# EAGLE design Qwiic MP3 (EAGLE 9.2.1)
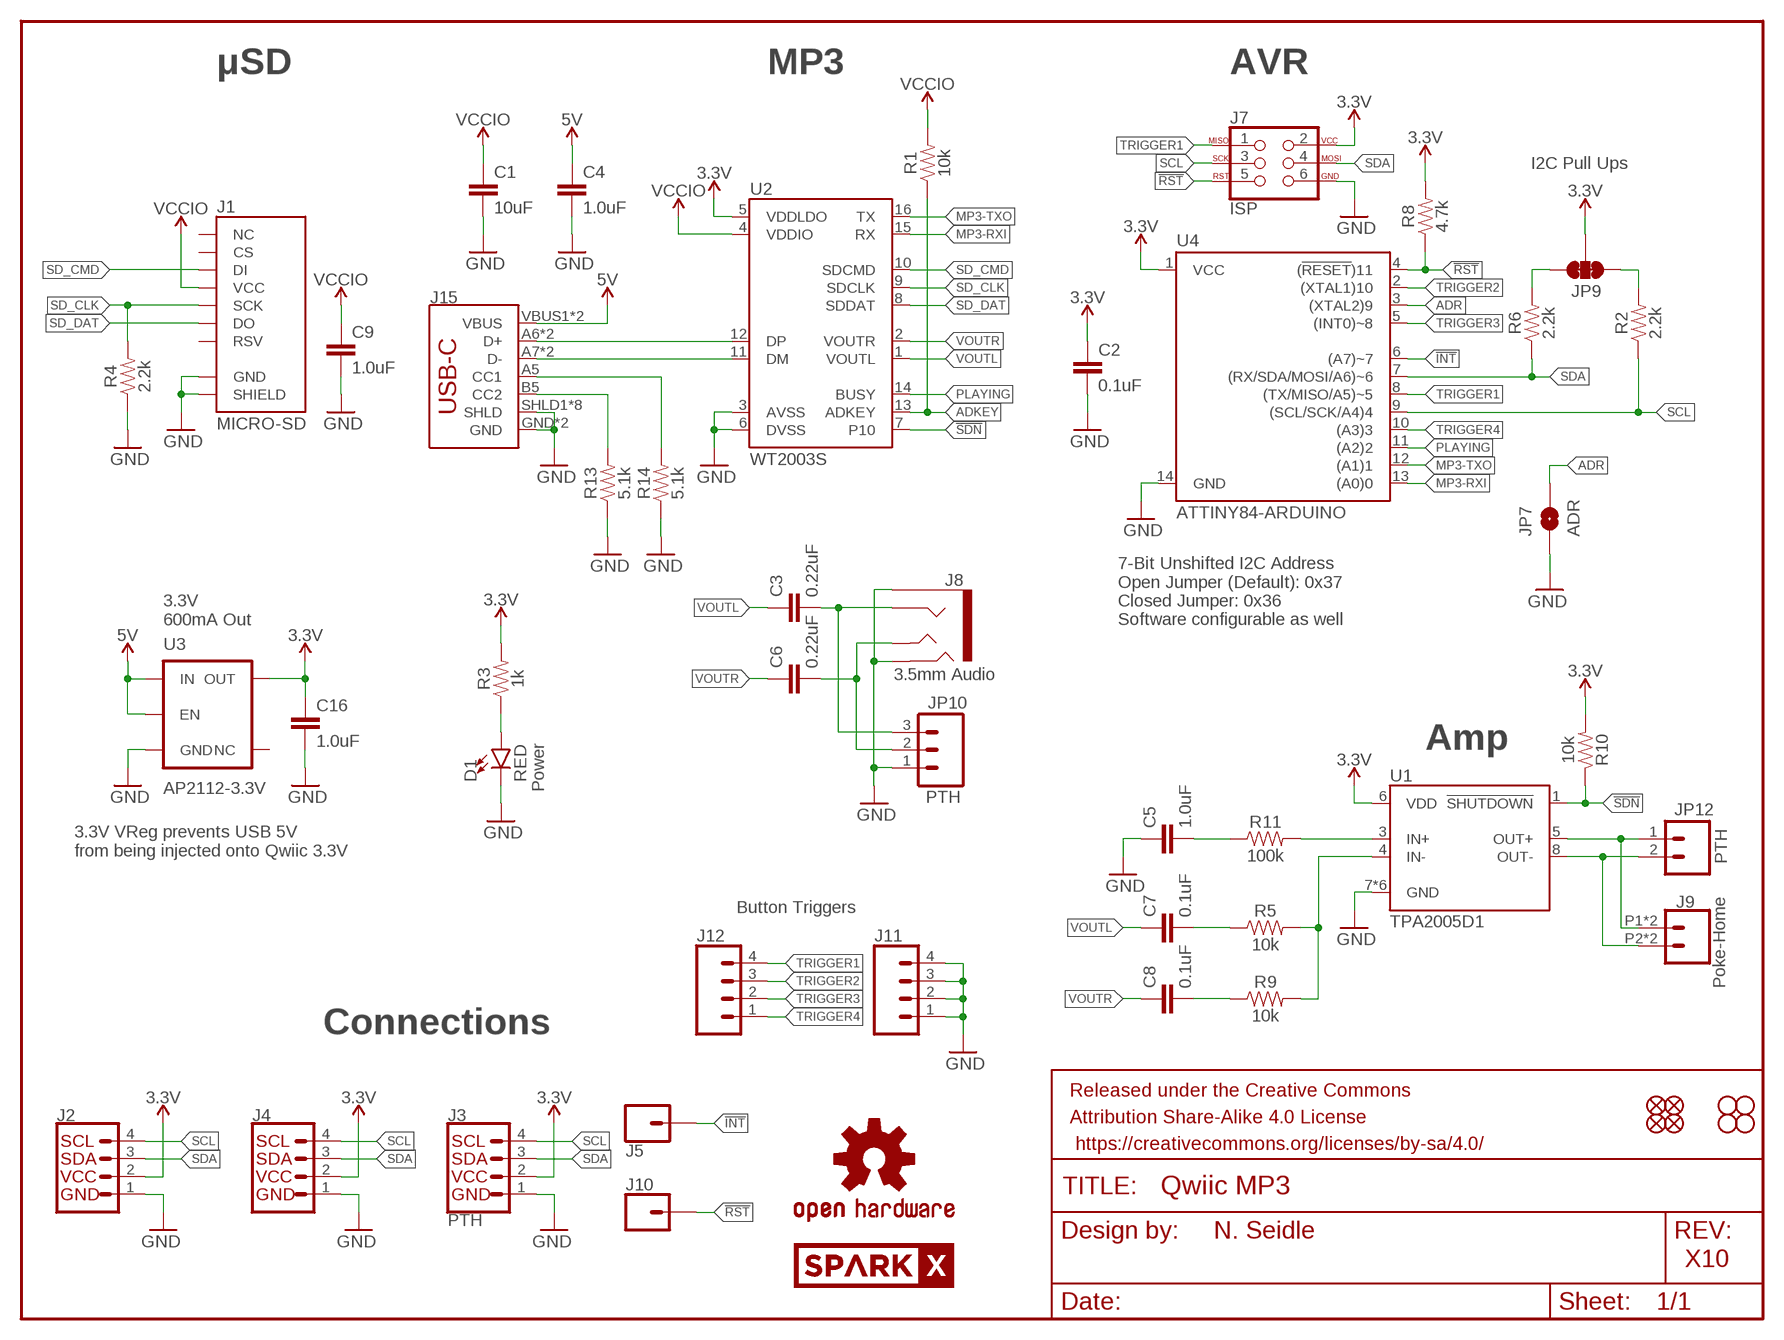
[diagram p0: schematic, sheet 1]

## Parts
C1  10uF  10UF-0603-6.3V-20%  [0603]
C2  0.1uF  0.1UF-0603-25V-(+80/-20%)  [0603]
C3  0.22uF  0.22UF-0603-25V-10%  [0603]
C4  1.0uF  1.0UF-0603-16V-10%  [0603]
C5  1.0uF  1.0UF-0603-16V-10%  [0603]
C6  0.22uF  0.22UF-0603-25V-10%  [0603]
C7  0.1uF  0.1UF-0603-25V-(+80/-20%)  [0603]
C8  0.1uF  0.1UF-0603-25V-(+80/-20%)  [0603]
C9  1.0uF  1.0UF-0603-16V-10%  [0603]
C16  1.0uF  1.0UF-0603-16V-10%  [0603]
D1  RED  LED-RED0603  [LED-0603]
FRAME1  FRAME-LETTER  [CREATIVE_COMMONS]
J1  MICRO-SD  MICRO-SD_CARD_SOCKETPUSH-PUSH  [MICRO-SD-SOCKET]
J2  QWIIC_CONNECTORJS-1MM  [1X04_1MM_RA]
J3  PTH  I2C_STANDARD_NO_SILK  [1X04_NO_SILK]
J4  QWIIC_CONNECTORJS-1MM  [1X04_1MM_RA]
J5  CONN_01PTH_NO_SILK_YES_STOP  [1X01_NO_SILK]
J7  ISP  AVR_SPI_PROG_3X2TESTPOINTS  [2X3_TEST_POINTS]
J8  3.5mm Audio  AUDIO_JACK_TRRSSMD_RA  [AUDIO_JACK_3.5MM_TRRS_SMD_RA]
J9  Poke-Home  CONN_02SMALL_POKEHOME  [1X02_POKEHOME]
J10  CONN_01PTH_NO_SILK_YES_STOP  [1X01_NO_SILK]
J11  CONN_041X04_NO_SILK  [1X04_NO_SILK]
J12  CONN_041X04_NO_SILK  [1X04_NO_SILK]
J15  USB_C16PIN  [USB-C-16P]
JP1  FIDUCIALUFIDUCIAL  [MICRO-FIDUCIAL]
JP2  FIDUCIALUFIDUCIAL  [MICRO-FIDUCIAL]
JP3  STAND-OFF  [STAND-OFF]
JP4  STAND-OFF  [STAND-OFF]
JP5  FIDUCIALUFIDUCIAL  [MICRO-FIDUCIAL]
JP6  FIDUCIALUFIDUCIAL  [MICRO-FIDUCIAL]
JP7  ADR  JUMPER-SMT_2_NO_NO-SILK  [SMT-JUMPER_2_NO_NO-SILK]
JP9  JUMPER-SMT_3_2-NC_TRACE_SILK  [SMT-JUMPER_3_2-NC_TRACE_SILK]
JP10  PTH  CONN_031X03_NO_SILK  [1X03_NO_SILK]
JP11  STAND-OFF  [STAND-OFF]
JP12  PTH  CONN_021X02_NO_SILK  [1X02_NO_SILK]
JP13  STAND-OFF  [STAND-OFF]
LOGO1  OSHW-LOGOMINI  [OSHW-LOGO-MINI]
R1  10k  10KOHM-0603-1/10W-1%  [0603]
R2  2.2k  2.2KOHM-0603-1/10W-1%  [0603]
R3  1k  1KOHM-0603-1/10W-1%  [0603]
R4  2.2k  2.2KOHM-0603-1/10W-1%  [0603]
R5  10k  10KOHM-0603-1/10W-1%  [0603]
R6  2.2k  2.2KOHM-0603-1/10W-1%  [0603]
R8  4.7k  4.7KOHM-0603-1/10W-1%  [0603]
R9  10k  10KOHM-0603-1/10W-1%  [0603]
R10  10k  10KOHM-0603-1/10W-1%  [0603]
R11  100k  100KOHM-0603-1/10W-1%  [0603]
R13  5.1k  5.1KOHM5.1KOHM-0603-1/10W-1%  [0603]
R14  5.1k  5.1KOHM5.1KOHM-0603-1/10W-1%  [0603]
U1  TPA2005D1  TPA2005D1DRB  [QFN-8_PAD]
U2  WT2003S  [SO16]
U3  AP2112-3.3V  V_REG_AP2112K-3.3V  [SOT23-5]
U4  ATTINY84-ARDUINO  [SO14]
U$1  SPARKX-LOGO3  [SPARKX-SMALL]
U$2  SPARKX-LOGO4  [SPARKX-MEDIUM]

## Nets
3.3V: C2.1 C16.1 J2.2 J3.2(VCC) J4.2 J7.2 JP9.2 R3.2 R8.2 R10.2 U1.6(VDD) U2.5(VDDLDO) U3.5(OUT) U4.1(VCC)
5V: C4.1 J15.VBUS1(VBUS) J15.VBUS2(VBUS) U3.1(IN) U3.3(EN)
!INT: J5.1 U4.6((A7)~7)
!RST: J7.5 J10.1 R8.1 U4.4((!RESET!)11)
!SDN: R10.1 U1.1(!SHUTDOWN) U2.7(P10)
AC-L: C3.2 J8.RING1 JP10.3
AC-R: C6.2 J8.TIP JP10.2
ADKEY: R1.1 U2.13(ADKEY)
ADR: JP7.2 U4.3((XTAL2)9)
D+: J15.A6(D+) J15.B6(D+) U2.12(DP)
D-: J15.A7(D-) J15.B7(D-) U2.11(DM)
GND: C1.2 C2.2 C4.2 C5.1 C9.2 C16.2 D1.C J1.CD1(SHIELD) J1.GND J2.1 J3.1(GND) J4.1 J7.6 J8.EARTH J8.RING2 J11.1 J11.2 J11.3 J11.4 J15.GND J15.GND2(GND) J15.SHLD1(SHLD) J15.SHLD2(SHLD) J15.SHLD3(SHLD) J15.SHLD4(SHLD) J15.SHLD5(SHLD) J15.SHLD6(SHLD) J15.SHLD7(SHLD) J15.SHLD8(SHLD) JP7.1 JP10.1 R4.1 R13.1 R14.1 U1.7(GND) U1.9(GND) U1.10(GND) U1.11(GND) U1.12(GND) U1.13(GND) U2.3(AVSS) U2.6(DVSS) U3.2(GND) U4.14(GND)
IN+AMP: R11.2 U1.3(IN+)
IN-AMP: R5.2 R9.2 U1.4(IN-)
MP3-RXI: U2.15(RX) U4.13((A0)0)
MP3-TXO: U2.16(TX) U4.12((A1)1)
N$1: J15.B5(CC2) R13.2
N$2: J15.A5(CC1) R14.2
N$3: D1.A R3.1
N$5: C8.2 R9.1
N$8: C5.2 R11.1
N$9: C7.2 R5.1
OUT+: J9.P1 J9.P3 JP12.1 U1.5(OUT+)
OUT-: J9.P2 J9.P4 JP12.2 U1.8(OUT-)
PLAYING: U2.14(BUSY) U4.11((A2)2)
SCL: J2.4 J3.4(SCL) J4.4 J7.3 R2.1 U4.9((SCL/SCK/A4)4)
SCL_PU1: JP9.1 R2.2
SD_CLK: J1.SCLK(SCK) R4.2 U2.9(SDCLK)
SD_CMD: J1.DI U2.10(SDCMD)
SD_DAT: J1.DO U2.8(SDDAT)
SDA: J2.3 J3.3(SDA) J4.3 J7.4 R6.1 U4.7((RX/SDA/MOSI/A6)~6)
SDA_PU1: JP9.3 R6.2
TRIGGER1: J7.1 J12.4 U4.8((TX/MISO/A5)~5)
TRIGGER2: J12.3 U4.2((XTAL1)10)
TRIGGER3: J12.2 U4.5((INT0)~8)
TRIGGER4: J12.1 U4.10((A3)3)
VCCIO: C1.1 C9.1 J1.VCC R1.2 U2.4(VDDIO)
VOUTL: C3.1 C7.1 U2.1(VOUTL)
VOUTR: C6.1 C8.1 U2.2(VOUTR)
Unconnected: J1.CS J1.RSV1(RSV) J1.RSV2(NC) U3.4(NC)

## Notes on the sheet
- μSD | MP3 | AVR
- I2C Pull Ups
- 3.3V
  600mA Out
- 7-Bit Unshifted I2C Address
  Open Jumper (Default): 0x37
  Closed Jumper: 0x36
  Software configurable as well
- Amp
- Power
- 3.3V VReg prevents USB 5V 
  from being injected onto Qwiic 3.3V
- Button Triggers
- Connections
- N. Seidle
- X10

## Library data of the parts
C1 = SparkFun-Capacitors:10UF: 10.0µF ceramic capacitors A capacitor is a passive two-terminal electrical component used to store electrical energy temporarily in an electric field.; PROD_ID: CAP-11015
C2 C7 C8 = SparkFun-Capacitors:0.1UF: 0.1µF ceramic capacitors A capacitor is a passive two-terminal electrical component used to store electrical energy temporarily in an electric field.; PROD_ID: CAP-00810
C3 C6 = SparkFun-Capacitors:0.22UF: 0.22µF ceramic capacitors A capacitor is a passive two-terminal electrical component used to store electrical energy temporarily in an electric field.; PROD_ID: CAP-07822
C4 C5 C9 C16 = SparkFun-Capacitors:1.0UF: 1µF ceramic capacitors A capacitor is a passive two-terminal electrical component used to store electrical energy temporarily in an electric field.; PROD_ID: CAP-00868
D1 = SparkFun-LED:LED-RED: Red SMD LED Used in manufacturing of most products at SparkFun Packages: 0603 - SMD 0603 package [Product Link] <http://docs.avagotech.com/docs/AV02-0551EN> 0603 SMART - SMD 0603 SMART package ( more efficient and expensive)[Product Link] <http://www.osram-os.com/Graphics/XPic2/00077099_0.pdf> 1206 - SMD1206 package [Product Link] <https://www.sparkfun.com/datasheets/DevTools/LilyPad/Q150OVS4.pdff> SparkFun Products: Pro Mini 328 -5V <https://www.sparkfun.com/products/821> RedBoard <https://www.sparkfun.com/products/12757> IOIO-OTG <https://www.sparkfun.com/products/13613>; PROD_ID: DIO-00819
FRAME1 = SparkFun-Aesthetics:FRAME-LETTER: Schematic Frame - Letter Standard 8.5x11 US Letter frame
J1 = SparkFun-Connectors:MICRO-SD_CARD_SOCKET: microSD Socket for Transflash Push-push type µSD socket. tDoc lines correctly indicate media card edge positions when inserting (unlocked, locked, depressed). NOTE: CD1 and CD2 are connected internally, and the default detect state of the socket is detect pin to ground. SparkFun Products: WAV Trigger <https://www.sparkfun.com/products/13660> CAN-Bus Shield <https://www.sparkfun.com/products/13262> SparkFun Level Shifing microSD Breakout <https://www.sparkfun.com/products/13743>; PROD_ID: CONN-07820
J2 J4 = SparkFun-Connectors:QWIIC_CONNECTOR: SparkFun I2C Standard Qwiic Connector An SMD 1mm pitch JST connector makes it easy and quick (get it? Qwiic?) to connect I2C devices to each other. The Qwiic system <http://www.sparkfun.com/qwiic> enables fast and solderless connection between popular platforms and various sensors and actuators. We carry 200mm <https://www.sparkfun.com/products/14204>, 100mm <https://www.sparkfun.com/products/14205>, 50mm <https://www.sparkfun.com/products/14206>, and breadboard friendly <https://www.sparkfun.com/products/14207> Qwiic cables. We also offer 10 pcs strips <https://www.sparkfun.com/products/14323> the SMD connectors.; PROD_ID: CONN-13694
J3 = SparkX:I2C_STANDARD: SparkFun I2C Standard Pinout Header SparkFun has standardized on a pinout for all I2C based sensor breakouts. This pinout allows I2C boards to be plugged directly into the headers on Arduino Uno compatible boards, and to be daisy chained easily. Example SparkFun Products: SparkFun Atmospheric Sensor Breakout - BME280 <https://www.sparkfun.com/products/13676> SparkFun Altitude/Pressure Sensor Breakout - MPL3115A2 <https://www.sparkfun.com/products/11084> SparkFun TOF Range Finder Sensor - VL6180 <https://www.sparkfun.com/products/12785>
J5 J10 = SparkFun-Connectors:CONN_01: Single connection point. Often used as Generic Header-pin footprint for 0.1 inch spaced/style header connections On any of the 0.1 inch spaced packages, you can populate with these: Break Away Headers - Straight <https://www.sparkfun.com/products/116> (PRT-00116) Break Away Male Headers - Right Angle <https://www.sparkfun.com/products/553> (PRT-00553) Female Headers <https://www.sparkfun.com/products/115> (PRT-00115) Break Away Headers - Machine Pin <https://www.sparkfun.com/products/117> (PRT-00117) Break Away Female Headers - Swiss Machine Pin <https://www.sparkfun.com/products/743> (PRT-00743) This device is also useful as a general connection point to wire up your design to another part of your project. Our various solder wires solder well into these plated through hole pads. Hook-Up Wire - Assortment (Stranded, 22 AWG) <https://www.sparkfun.com/products/11375> (PRT-11375) Hook-Up Wire - Assortment (Solid Core, 22 AWG) <https://www.sparkfun.com/products/11367> (PRT-11367) View the entire wire category on our website here <https://www.sparkfun.com/categories/141> Special notes: SMTSO-256-ET is a "flush mount" nut for a 4-40 screw. We mostly use this on specialty testbeds; it is a nice way to connect hardware to your PCB at an adjustable hieght. Also note, the SNAP packages are for using a snappable style connector. We sell a baggie of snaps and they are also used on two LilyPad designs: Snap Assortment - 30 pack (male and female) <https://www.sparkfun.com/products/11347> (DEV-11347) LilyPad Arduino SimpleSnap <https://www.sparkfun.com/products/10941> (DEV-10941) LilyPad SimpleSnap Protoboard <https://www.sparkfun.com/products/10940> (DEV-10940)
J7 = SparkFun-Connectors:AVR_SPI_PROG_3X2: AVR ISP 6 Pin This is the reduced ISP connector for AVR programming. Common on Arduino. This footprint will take up less PCB space and can be used with a 10-pin to 6-pin adapter such as SKU: BOB-08508 **Special note about "TEST_POINT" package. The stop mask is on the top side, so if you want your programming test points to be on the bottom of your board, make sure to place this package on the bottom side of the board. This also ensure that the orientation to program from the bottom side will be correct. SparkFun Products: SparkFun ISP Pogo Adapter <https://www.sparkfun.com/products/11591> - NS Tiny AVR Programmer <https://www.sparkfun.com/products/11801> -PTH
J8 = SparkFun-Connectors:AUDIO_JACK_TRRS: Audio Jack - 3.5mm TRRS (SMD) This is a 3.5mm TRRS SMD audio jack. TRRS connectors are the audio-style connectors that you see on some phones, MP3 players and development boards. TRRS stands for “tip, ring, ring, sleeve,” which reflects that this has three conductors and a ground. SparkFun Products: Audio Jack <https://www.sparkfun.com/products/12639> mbed Starter Kit <https://www.sparkfun.com/products/12968> SparkFun TRRS 3.5mm Jack Breakout <https://www.sparkfun.com/products/11570>; PROD_ID: CONN-10676; SF_ID: PRT-12639
J9 = SparkFun-Connectors:CONN_02: Multi connection point. Often used as Generic Header-pin footprint for 0.1 inch spaced/style header connections On any of the 0.1 inch spaced packages, you can populate with these: Break Away Headers - Straight <https://www.sparkfun.com/products/116> (PRT-00116) Break Away Male Headers - Right Angle <https://www.sparkfun.com/products/553> (PRT-00553) Female Headers <https://www.sparkfun.com/products/115> (PRT-00115) Break Away Headers - Machine Pin <https://www.sparkfun.com/products/117> (PRT-00117) Break Away Female Headers - Swiss Machine Pin <https://www.sparkfun.com/products/743> (PRT-00743) For SCREWTERMINALS and SPRING TERMINALS visit here: Screw Terimnals on SparkFun.com <https://www.sparkfun.com/search/results?term=Screw+Terminals> (5mm/3.5mm/2.54mm spacing) This device is also useful as a general connection point to wire up your design to another part of your project. Our various solder wires solder well into these plated through hole pads. Hook-Up Wire - Assortment (Stranded, 22 AWG) <https://www.sparkfun.com/products/11375> (PRT-11375) Hook-Up Wire - Assortment (Solid Core, 22 AWG) <https://www.sparkfun.com/products/11367> (PRT-11367) View the entire wire category on our website here <https://www.sparkfun.com/categories/141> Special notes: Molex polarized connector foot print use with: PRT-08233 with associated crimp pins and housings. 2.54_SCREWTERM for use with PRT-10571. 3.5mm Screw Terminal footprints for PRT-08084 5mm Screw Terminal footprints for use with PRT-08432; PROD_ID: CONN-13512
J11 J12 = SparkFun-Connectors:CONN_04: Multi connection point. Often used as Generic Header-pin footprint for 0.1 inch spaced/style header connections On any of the 0.1 inch spaced packages, you can populate with these: Break Away Headers - Straight <https://www.sparkfun.com/products/116> (PRT-00116) Break Away Male Headers - Right Angle <https://www.sparkfun.com/products/553> (PRT-00553) Female Headers <https://www.sparkfun.com/products/115> (PRT-00115) Break Away Headers - Machine Pin <https://www.sparkfun.com/products/117> (PRT-00117) Break Away Female Headers - Swiss Machine Pin <https://www.sparkfun.com/products/743> (PRT-00743) For SCREWTERMINALS and SPRING TERMINALS visit here: Screw Terimnals on SparkFun.com <https://www.sparkfun.com/search/results?term=Screw+Terminals> (5mm/3.5mm/2.54mm spacing) This device is also useful as a general connection point to wire up your design to another part of your project. Our various solder wires solder well into these plated through hole pads. Hook-Up Wire - Assortment (Stranded, 22 AWG) <https://www.sparkfun.com/products/11375> (PRT-11375) Hook-Up Wire - Assortment (Solid Core, 22 AWG) <https://www.sparkfun.com/products/11367> (PRT-11367) View the entire wire category on our website here <https://www.sparkfun.com/categories/141> Special notes: Molex polarized connector foot print use with SKU : PRT-08231 with associated crimp pins and housings. 1MM SMD Version SKU: PRT-10208; PROD_ID: CONN-09696
J15 = SparkFun-Connectors:USB_C: USB Type C 16Pin Connector Super Speed pins not available on the 16-pin purely SMD connector so this part is best for USB 2.0 implementations. D1 and D2 are tied together enabling D+/- no matter which way the cable is plugged into the connector. The two channel configuration pins (CC1/2) are exposed. These are normally connected to ground via 5.1k resistors but can be reconfigured for high current/high power applications.; PROD_ID: CONN-14122
JP1 JP2 JP5 JP6 = SparkFun:FIDUCIAL: Fiducial Alignment Points Various fiducial points for machine vision alignment.
JP3 JP4 JP11 JP13 = SparkFun:STAND-OFF: Stand Off This is the mechanical footprint for a #4 phillips button head screw. Use the keepout ring to avoid running the screw head into surrounding components. SKU : PRT-00447
JP7 = SparkFun-Jumpers:JUMPER-SMT_2_NO: Normally open jumper This jumper has two pads in close proximity to each other. Apply solder to close the connection. Round pads are easier to solder for beginners, but are a lot larger. SparkFun Product that uses the round pads: SparkFun EL Sequencer <https://www.sparkfun.com/products/12781>
JP9 = SparkFun-Jumpers:JUMPER-SMT_3_2-NC_TRACE: Normally closed trace jumper (2 of 2 connections) This jumper has a trace between all three pads so they are normally closed (NC). Use a razor knife to open the connection(s). For best results follow the IPC guidelines for cutting traces: Cutout at least 0.063 mm (0.005 in). Remove all loose material to clean up the cut area. Seal the cut with an approved epoxy. Reapply solder to reclose the connection(s).
JP10 = SparkFun-Connectors:CONN_03: Multi connection point. Often used as Generic Header-pin footprint for 0.1 inch spaced/style header connections On any of the 0.1 inch spaced packages, you can populate with these: Break Away Headers - Straight <https://www.sparkfun.com/products/116> (PRT-00116) Break Away Male Headers - Right Angle <https://www.sparkfun.com/products/553> (PRT-00553) Female Headers <https://www.sparkfun.com/products/115> (PRT-00115) Break Away Headers - Machine Pin <https://www.sparkfun.com/products/117> (PRT-00117) Break Away Female Headers - Swiss Machine Pin <https://www.sparkfun.com/products/743> (PRT-00743) Stackable Header - 3 Pin (Female, 0.1") <https://www.sparkfun.com/products/13875> (PRT-13875) For SCREWTERMINALS and SPRING TERMINALS visit here: Screw Terimnals on SparkFun.com <https://www.sparkfun.com/search/results?term=Screw+Terminals> (5mm/3.5mm/2.54mm spacing) This device is also useful as a general connection point to wire up your design to another part of your project. Our various solder wires solder well into these plated through hole pads. Hook-Up Wire - Assortment (Stranded, 22 AWG) <https://www.sparkfun.com/products/11375> (PRT-11375) Hook-Up Wire - Assortment (Solid Core, 22 AWG) <https://www.sparkfun.com/products/11367> (PRT-11367) View the entire wire category on our website here <https://www.sparkfun.com/categories/141> Special notes: Molex polarized connector foot print use with SKU : PRT-08232 with associated crimp pins and housings.
JP12 = SparkFun-Connectors:CONN_02: Multi connection point. Often used as Generic Header-pin footprint for 0.1 inch spaced/style header connections On any of the 0.1 inch spaced packages, you can populate with these: Break Away Headers - Straight <https://www.sparkfun.com/products/116> (PRT-00116) Break Away Male Headers - Right Angle <https://www.sparkfun.com/products/553> (PRT-00553) Female Headers <https://www.sparkfun.com/products/115> (PRT-00115) Break Away Headers - Machine Pin <https://www.sparkfun.com/products/117> (PRT-00117) Break Away Female Headers - Swiss Machine Pin <https://www.sparkfun.com/products/743> (PRT-00743) For SCREWTERMINALS and SPRING TERMINALS visit here: Screw Terimnals on SparkFun.com <https://www.sparkfun.com/search/results?term=Screw+Terminals> (5mm/3.5mm/2.54mm spacing) This device is also useful as a general connection point to wire up your design to another part of your project. Our various solder wires solder well into these plated through hole pads. Hook-Up Wire - Assortment (Stranded, 22 AWG) <https://www.sparkfun.com/products/11375> (PRT-11375) Hook-Up Wire - Assortment (Solid Core, 22 AWG) <https://www.sparkfun.com/products/11367> (PRT-11367) View the entire wire category on our website here <https://www.sparkfun.com/categories/141> Special notes: Molex polarized connector foot print use with: PRT-08233 with associated crimp pins and housings. 2.54_SCREWTERM for use with PRT-10571. 3.5mm Screw Terminal footprints for PRT-08084 5mm Screw Terminal footprints for use with PRT-08432
LOGO1 = SparkFun-Aesthetics:OSHW-LOGO: Open-Source Hardware (OSHW) Logo This logo indicates the piece of hardware it is found on incorporates a OSHW license and/or adheres to the definition of open source hardware found here: http://freedomdefined.org/OSHW
R1 R5 R9 R10 = SparkFun-Resistors:10KOHM: 10kΩ resistor A resistor is a passive two-terminal electrical component that implements electrical resistance as a circuit element. Resistors act to reduce current flow, and, at the same time, act to lower voltage levels within circuits. - Wikipedia; PROD_ID: RES-00824
R2 R4 R6 = SparkFun-Resistors:2.2KOHM: 2.2kΩ resistor A resistor is a passive two-terminal electrical component that implements electrical resistance as a circuit element. Resistors act to reduce current flow, and, at the same time, act to lower voltage levels within circuits. - Wikipedia; PROD_ID: RES-08272
R3 = SparkFun-Resistors:1KOHM: 1kΩ resistor A resistor is a passive two-terminal electrical component that implements electrical resistance as a circuit element. Resistors act to reduce current flow, and, at the same time, act to lower voltage levels within circuits. - Wikipedia; PROD_ID: RES-07856
R8 = SparkFun-Resistors:4.7KOHM: 4.7kΩ resistor A resistor is a passive two-terminal electrical component that implements electrical resistance as a circuit element. Resistors act to reduce current flow, and, at the same time, act to lower voltage levels within circuits. - Wikipedia; PROD_ID: RES-07857
R11 = SparkFun-Resistors:100KOHM: 100kΩ resistor A resistor is a passive two-terminal electrical component that implements electrical resistance as a circuit element. Resistors act to reduce current flow, and, at the same time, act to lower voltage levels within circuits. - Wikipedia; PROD_ID: RES-07828
R13 R14 = SparkFun-Resistors:5.1KOHM; PROD_ID: RES-12083
U1 = SparkFun-IC-Amplifiers:TPA2005D1: 1.4W MONO CLASS-D AUDIO POWER AMPLIFIER The TPA2005D1 is a 1.4-W high efficiency filter-free class-D audio power amplifier in a BGA, QFN, or MSOP package that requires only three external components. Datasheet: http://focus.ti.com/lit/ds/symlink/tpa2005d1.pdf 1.4 W Into 8 ? From a 5V Supply at THD = 10% (Typ) Maximum Battery Life and Minimum Heat Efficiency With an 8-? Speaker: 84% at 400 mW, 79% at 100 mW 2.8-mA Quiescent Current 0.5-mA Shutdown Current Ideal for Wireless or Cellular Handsets and PDAs Capable of Driving an 8-? Speaker (2.5 V ? VDD ? 5.5 V) and a 4-? Speaker (2.5 V ? VDD ? 4.2 V) Only Three External Components Optimized PWM Output Stage Eliminates LC Output Filter Internally Generated 250-kHz Switching Frequency Eliminates Capacitor and Resistor Improved PSRR (-71 dB at 217 Hz) and Wide Supply Voltage (2.5 V to 5.5 V) Eliminates Need for a Voltage Regulator Fully Differential Design Reduces RF Rectification and Eliminates Bypass Capacitor Improved CMRR Eliminates Two Input Coupling Capacitors SparkFun Products SparkFun Mono Audio Amp Breakout - TPA2005D1 <https://www.sparkfun.com/products/11044> (BOB-11044) Note: SparkFun currenly only uses the QFN style part; PROD_ID: IC-10975
U2 = WT2003S:WT2003S
U3 = SparkFun-PowerIC:V_REG_AP2112: AP2112 - 600mA CMOS LDO Regulator w/ Enable The AP2112 is CMOS process low dropout linear regulator with enable function, the regulator delivers a guaranteed 600mA (min.) continuous load current. Features Output Voltage Accuracy: ±1.5% Output Current: 600mA (Min.) Foldback Short Current Protection: 50mA Enable Function to Turn ON/OFF VOUT Low Dropout Voltage (3.3V): 250mV (Typ.) @IOUT=600mA Excellent Load Regulation: 0.2%/A (Typ.) Excellent Line Regulation: 0.02%/V (Typ.) Low Quiescent Current: 55μA (Typ.) Low Standby Current: 0.01μA (Typ.) Low Output Noise: 50μVRMS PSRR: 100Hz -65dB, 1kHz -65dB OTSD Protection Stable with 1.0μF Flexible Cap: Ceramic, Tantalum and Aluminum Electrolytic Operation Temperature Range: -40°C to 85°C ESD: MM 400V, HBM 4000V; PROD_ID: VREG-12457; VALUE: 3.3V
U4 = SparkFun-IC-Microcontroller:ATTINY84-ARDUINO; PROD_ID: IC-14155
U$1 U$2 = SparkX:SPARKX-LOGO

## Net classes
1 3.3V: width 0.152 mm

## Board
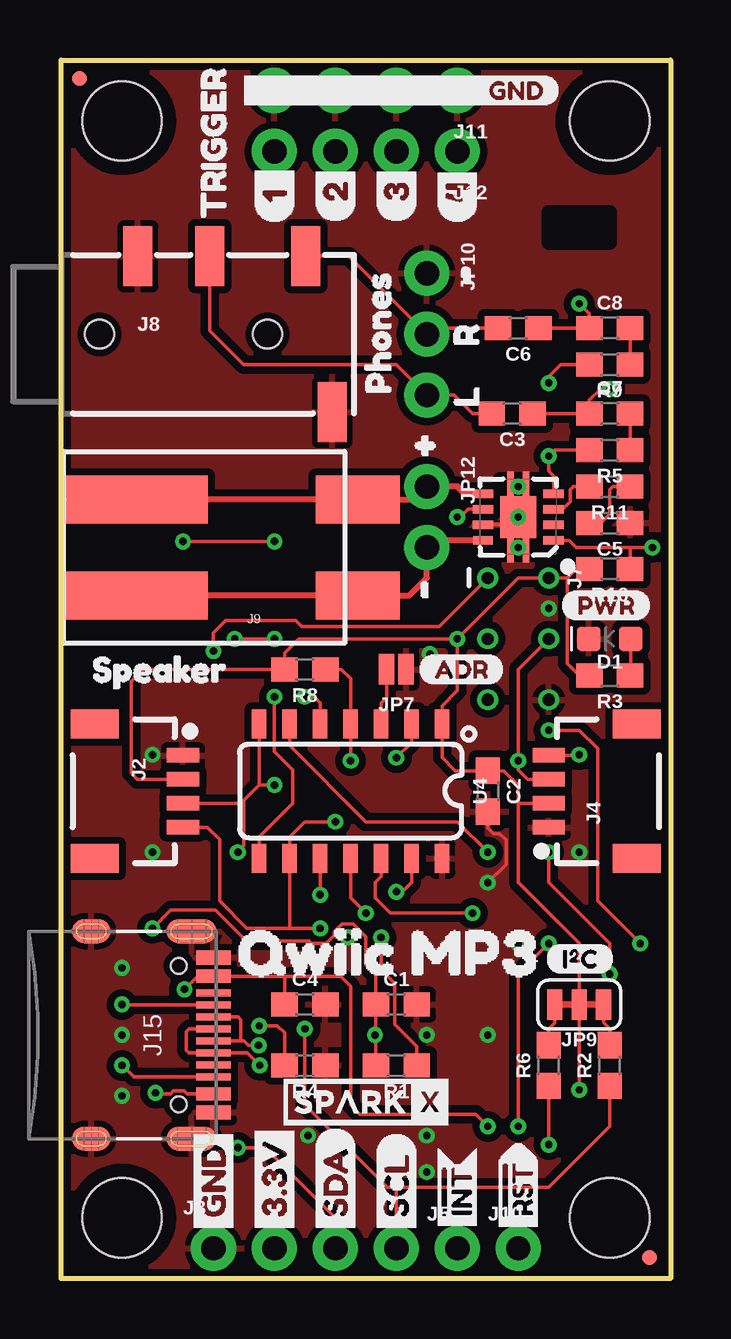
[diagram p1: board, top side]
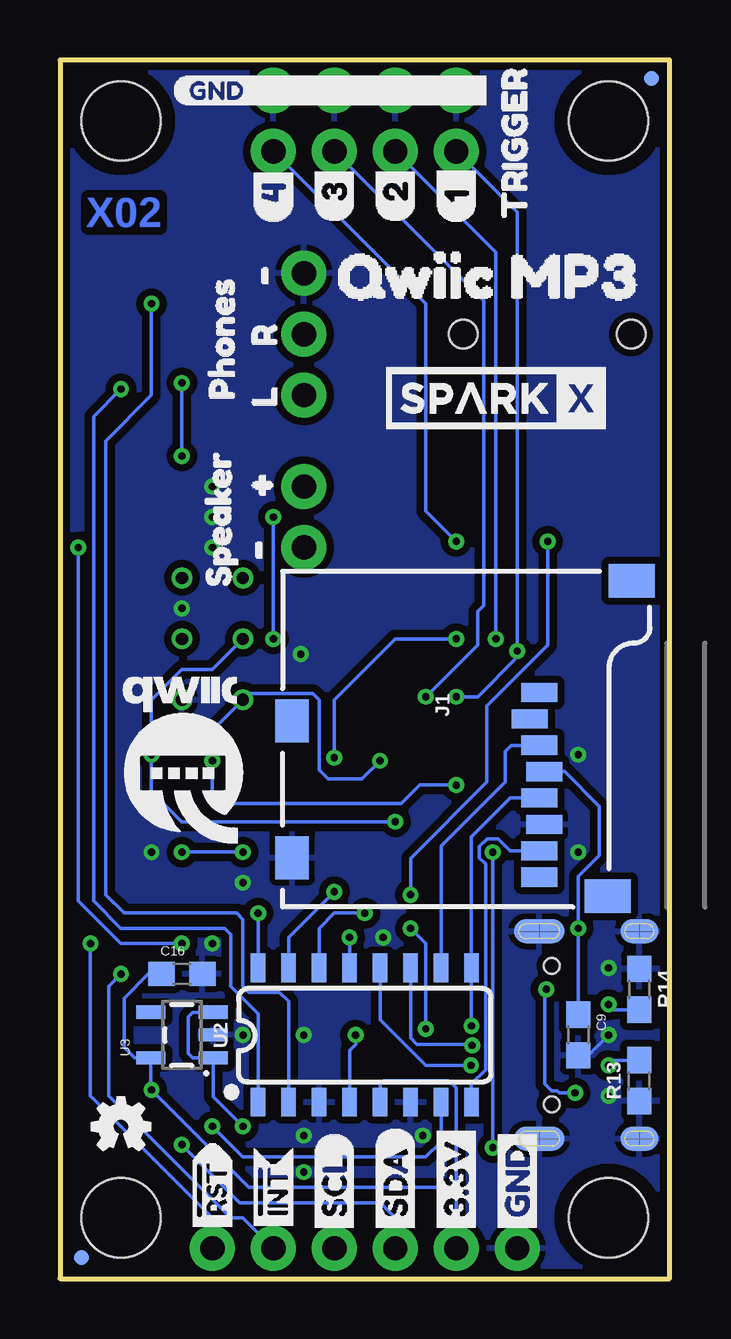
[diagram p2: board, bottom side, seen from below]

Size 25.4 x 50.8 mm. Coordinates in mm from the lower left corner, seen from the top.
Outline: 0,0 0,50.8 25.4,50.8 25.4,0 0,0
Copper layers (1*16): Top 0.035mm / dielectric 1.5mm / Bottom 0.035mm
Design rules "SparkFun-2-layer-PCBWay-LIMIT *": minimum track width 6mil, minimum drill 0.3mm, track to track 6mil, track to pad 6mil, pad to pad 6mil, via to via 6mil, smd to smd 6mil, copper to edge 6mil, drill to drill 6mil, minimum pad ring 7mil, minimum via ring 7mil, stop-mask expansion 4mil, vias tented up to drill 25mil, thermal gap 10mil
tRestrict: area 20.3,43.2 to 22.9,44.5

### Footprints (pad centres in the part's own frame; a part is rotated, then mirrored left to right if it is on the bottom)
0603 = smd 1.1 x 1: 1 -0.85,0; 2 0.85,0
LED-0603 = smd 1 x 1: A -0.877,0; C 0.877,0
MICRO-SD-SOCKET = smd 1.8 x 1.4: CD1 -2.05,0.4; CD2 -7.75,0.4 | smd 0.8 x 1.5: CS -7.84,10.3; DI -6.74,10.7; DO -2.34,10.7; GND -3.44,10.9; RSV1 -8.94,10.7; RSV2 -1.24,10.7; SCLK -4.54,10.7; VCC -5.64,10.9 | smd 1.4 x 1.9: GND1 -13.6,14.55; GND3 -0.45,13.55
1X04_1MM_RA = smd 0.6 x 1.35: 1 -1.5,0; 2 -0.5,0; 3 0.5,0; 4 1.5,0 | smd 1.2 x 2: NC1 2.8,-3.675; NC2 -2.8,-3.675
1X04_NO_SILK = drill 1.016 pad 1.88: 1 0,0; 2 2.54,0; 3 5.08,0; 4 7.62,0
1X01_NO_SILK = drill 1.016 pad 1.88: 1 0,0
2X3_TEST_POINTS = drill 0.508: 1 -2.54,-1.27; 2 -2.54,1.27; 3 0,-1.27; 4 0,1.27; 5 2.54,-1.27; 6 2.54,1.27
AUDIO_JACK_3.5MM_TRRS_SMD_RA = smd 1.2 x 2.5: EARTH 11.3,-3.25; RING1 6.2,3.25; RING2 3.2,3.25; TIP 10.2,3.25 | hole 1.2: 1.6,0; 8.6,0
1X02_POKEHOME = smd 3.5 x 2: P1 5.25,2; P2 5.25,-2 | smd 6 x 2: P3 -4,2; P4 -4,-2
USB-C-16P = smd 0.3 x 1.45: A5 -1.25,0; A6 -0.25,0; A7 0.25,0; A8 1.25,0; B5 1.75,0; B6 0.75,0; B7 -0.75,0; B8 -1.75,0 | smd 0.6 x 1.45: GND -3.225,0; GND2 3.225,0 | smd 1 x 2.1: SHLD1 -4.32,-0.915; SHLD2 4.32,-0.915 | smd 1 x 2.1 bottom: SHLD3 -4.32,-0.915; SHLD4 4.32,-0.915 | smd 1 x 1.6: SHLD5 -4.32,-5.095; SHLD8 4.32,-5.095 | smd 1 x 1.6 bottom: SHLD6 -4.32,-5.095; SHLD7 4.32,-5.095 | smd 0.55 x 1.45: VBUS1 -2.45,0; VBUS2 2.45,0 | hole 0.65: -2.89,-1.445; 2.89,-1.445
MICRO-FIDUCIAL = smd 0.635 x 0.635: 1 0,0
STAND-OFF = hole 3.302: 0,0
SMT-JUMPER_2_NO_NO-SILK = smd 0.635 x 1.27: 1 -0.406,0; 2 0.406,0
SMT-JUMPER_3_2-NC_TRACE_SILK = smd 0.635 x 1.27: 1 -1.016,0; 2 0,0; 3 1.016,0
1X03_NO_SILK = drill 1.016 pad 1.88: 1 0,0; 2 2.54,0; 3 5.08,0
1X02_NO_SILK = drill 1.016 pad 1.88: 1 0,0; 2 2.54,0
QFN-8_PAD = smd 0.35 x 0.85: 1 -0.975,-1.475; 2 -0.325,-1.475; 3 0.325,-1.475; 4 0.975,-1.475; 5 0.975,1.475; 6 0.325,1.475; 7 -0.325,1.475; 8 -0.975,1.475 | smd 1.75 x 1.5: 9 0,0 | smd 1.025 x 0.28: 10 -1.387,-0.325; 11 1.387,-0.325; 12 1.387,0.325; 13 -1.387,0.325
SO16 = smd 0.6 x 1.2: 1 -4.445,-2.8; 2 -3.175,-2.8; 3 -1.905,-2.8; 4 -0.635,-2.8; 5 0.635,-2.8; 6 1.905,-2.8; 7 3.175,-2.8; 8 4.445,-2.8; 9 4.445,2.8; 10 3.175,2.8; 11 1.905,2.8; 12 0.635,2.8; 13 -0.635,2.8; 14 -1.905,2.8; 15 -3.175,2.8; 16 -4.445,2.8
SOT23-5 = smd 0.55 x 1.2: 1 -0.95,-1.3; 2 0,-1.3; 3 0.95,-1.3; 4 0.95,1.3; 5 -0.95,1.3
SO14 = smd 0.6 x 1.2: 1 -3.175,-2.8; 2 -1.905,-2.8; 3 -0.635,-2.8; 4 0.635,-2.8; 5 1.905,-2.8; 6 3.175,-2.8; 7 4.445,-2.8; 8 4.445,2.8; 9 3.175,2.8; 10 1.905,2.8; 11 0.635,2.8; 12 -0.635,2.8; 13 -1.905,2.8; 14 -3.175,2.8

### Placement (x,y rotation side)
C1  13.97,11.43 0 top
C2  17.78,20.32 270 top
C3  18.8,36.07 180 top
C4  10.16,11.43 0 top
C5  22.86,31.5 180 top
C6  19.05,39.62 180 top
C7  22.86,36.07 0 top
C8  22.86,39.62 0 top
C9  3.81,10.16 270 bottom
C16  20.32,12.7 0 bottom
D1  22.86,26.67 180 top
FRAME1  -20.32,-17.78 0 top  (outside the outline)
J1  16.13,15.49 270 bottom
J2  5.08,20.32 270 top
J3  6.35,1.27 0 top
J4  20.32,20.32 90 top
J5  16.51,1.27 0 top
J7  19.05,26.67 270 top
J8  0,39.37 0 top
J9  7.11,30.48 0 top
J10  19.05,1.27 0 top
J11  16.51,49.53 180 top
J12  16.51,46.99 180 top
J15  6.35,10.16 270 top
JP1  0.76,50.04 0 bottom
JP2  24.51,0.89 0 top
JP3  2.54,48.26 0 top
JP4  22.86,48.26 0 top
JP5  24.51,0.89 0 bottom
JP6  0.76,50.04 0 top
JP7  13.97,25.4 180 top
JP9  21.59,11.43 180 top
JP10  15.24,41.91 270 top
JP11  2.54,2.54 0 top
JP12  15.24,33.02 270 top
JP13  22.86,2.54 0 top
LOGO1  22.86,6.35 0 bottom
R1  13.97,8.89 180 top
R2  22.86,8.89 90 top
R3  22.86,25.15 180 top
R4  10.16,8.89 180 top
R5  22.86,34.54 180 top
R6  20.32,8.89 90 top
R8  10.16,25.4 180 top
R9  22.86,38.1 180 top
R10  22.86,29.59 180 top
R11  22.86,33.02 180 top
R13  1.27,8.26 90 bottom
R14  1.27,12.06 270 bottom
U1  19.05,31.75 90 top
U2  12.7,10.16 0 bottom
U3  20.32,10.16 90 bottom
U4  12.7,20.32 180 top
U$1  12.7,7.37 0 top
U$2  7.24,36.7 0 bottom
U$3  [GND1]  6.35,1.65 90 bottom
U$4  [3#3V2]  8.89,1.65 90 bottom
U$5  [SDA8]  11.43,1.65 90 bottom
U$6  [SCL9]  13.97,1.65 90 bottom
U$7  [RST#-[>]  19.05,1.52 90 top
U$8  [I_SUPER2_C-()-03]  20.19,13.34 0 top
U$9  [INT#-[<]  16.51,1.52 90 top
U$10  [#6]  16.64,40.26 90 top
U$11  [INT#-[<]  16.51,1.52 90 bottom
U$12  [#5]  14.99,33.15 90 top
U$13  [#6]  14.86,27.18 90 top
U$14  [SPEAKER1]  18.8,27.94 90 bottom
U$15  [PHONES0]  13.21,35.81 90 top
U$16  [RST#-[>]  19.05,1.52 90 bottom
U$17  [PWR-()-03]  20.83,28.07 0 top
U$18  [ADR-()-03]  14.86,25.4 0 top
U$19  [1_1]  8.89,43.94 90 top
U$20  [SPEAKER1]  0.38,25.4 0 top
U$21  [3#3V2]  8.89,1.65 90 top
U$22  [GND1]  6.35,1.65 90 top
U$23  [QWIIC_MP32]  5.71,13.59 0 top
U$24  [QWIIC_MP32]  15.49,41.78 0 bottom
U$25  [#6]  17.4,28.83 90 bottom
U$26  [SCL9]  13.97,1.65 90 top
U$27  [SDA8]  11.43,1.65 90 top
U$28  [#5]  17.14,31.5 90 bottom
U$29  [TRIGGER5]  6.35,43.31 90 top
U$31  [43]  16.51,43.94 90 bottom
U$32  [21]  11.43,43.81 90 top
U$33  [32]  13.97,43.81 90 top
U$34  [43]  16.51,43.94 90 top
U$35  [GND0]  17.14,49.53 0 top
U$36  [32]  13.97,43.81 90 bottom
U$37  [L12]  16.89,35.43 90 top
U$38  [#6]  17.14,40.26 90 bottom
U$39  [R11]  16.89,37.97 90 bottom
U$40  [PHONES0]  18.67,35.56 90 bottom
U$41  [L12]  16.89,35.43 90 bottom
U$42  [21]  11.43,43.81 90 bottom
U$43  [R11]  16.89,37.97 90 top
U$44  [1_1]  8.89,43.94 90 bottom
U$45  [TRIGGER5]  6.48,43.31 90 bottom
U$46  [GND0]  20.7,49.53 0 bottom
U$47  [QWIIC-LOGO-MEDIUM]  20.32,21.59 0 bottom

### Tracks (layer width: path | path; a pad name or v marks a point on that pad's centre or on a via)
3.3V  (via drill 0.3)
  Top 0.152: v21.59,7.87 JP9.2 21.59,13.97 19.05,16.51 19.05,19.81 | J2.2 3.18,20.82 2.92,21.08 2.92,24.89 3.43,25.4 R8.2 9.31,26.07 9.91,26.67 v16.51,26.67 | 21.08,29.21 J7.2 19.05,29.21 v16.51,26.67 | R10.2 21.46,29.59 21.08,29.21 | 19.05,19.81 19.05,20.57 18.45,21.17 C2.1 16.42,21.17 15.88,21.72 U4.1 15.88,23.88 16.51,24.51 v16.51,26.67 | J4.2 19.06,19.82 19.05,19.81 | R3.2 21.59,25.15 21.08,25.65 21.08,29.21 | v16.51,31.75 16.51,31.62 16.96,32.08 U1.6
  Bottom 0.152: v16.51,31.75 v16.51,26.67 | C16.1 21.72,12.7 22.73,11.68 22.73,9.65 22.29,9.21 U3.5 21.62,7.9 v21.59,7.87 17.53,3.81 8.89,3.81 | U2.5 12.06,8.13 11.94,8.26 9.2,8.26 8.89,7.95 8.89,3.81 | 8.89,3.81 J3.2
5V  (via drill 0.3)
  Top 0.152: v17.78,6.35 17.27,6.86 12.45,6.86 12.06,7.24 12.06,12.19 11.65,12.61 9.27,12.61 | 9.27,12.61 J15.VBUS1 5.69,12.61 v5.14,12.06 | C4.1 9.31,12.57 9.27,12.61 | v3.94,7.75 3.97,7.71 4.56,7.71 4.68,7.82 5.13,7.82 5.25,7.71 J15.VBUS2
  Bottom 0.152: U3.3 19.88,11.11 20.07,10.92 20.07,9.4 19.88,9.21 U3.1 19.02,7.59 v17.78,6.35 | v3.94,7.75 4.6,7.75 4.68,7.82 4.9,7.82 5.21,8.13 5.21,12 v5.14,12.06
!INT  (via drill 0.3)
  Top 0.152: v22.86,12.7 22.86,13.97 20.32,16.51 v20.32,17.78 | U4.6 9.53,22.23 12.7,19.05 16.51,19.05 v17.78,17.78
  Bottom 0.152: J5.1 17.78,2.54 18.29,2.54 23.37,7.62 23.37,12.19 v22.86,12.7 | v17.78,17.78 v20.32,17.78
!RST  (via drill 0.3)
  Top 0.152: R8.1 11.68,25.4 12.06,25.02 U4.4 v12.06,21.59 | v24.13,13.97 22.35,15.75 22.35,22.1 21.59,22.86 v20.32,22.86
  Bottom 0.152: J10.1 19.05,2.54 24.13,7.62 v24.13,13.97 | v12.06,21.59 12.83,20.83 14.22,20.83 14.61,21.21 14.61,24.13 14.86,24.38 17.53,24.38 J7.5 19.05,22.86 v20.32,22.86
!SDN  (via drill 0.3)
  Top 0.152: U1.1 21.17,30.77 21.46,30.48 23.75,30.48 | 23.75,30.48 v24.64,30.48 | R10.1 23.71,30.44 23.75,30.48 | v19.05,6.35 19.05,12.7 v20.32,13.97
  Bottom 0.152: U2.7 9.53,5.71 10.16,5.08 17.78,5.08 v19.05,6.35 | v24.64,30.48 24.64,15.75 22.86,13.97 v20.32,13.97
AC-L
  Top 0.152: J8.RING1 6.2,39.52 7.62,38.1 13.97,38.1 JP10.3 16.38,36.83 17.14,36.07 C3.2
AC-R
  Top 0.152: J8.TIP 11.99,42.62 JP10.2 15.49,39.62 C6.2
ADKEY  (via drill 0.3)
  Top 0.152: R1.1 14.82,9.69 13.9,10.61 13.9,12.31 13.34,12.88 v13.34,14.22
  Bottom 0.152: U2.13 v13.34,14.22
ADR
  Top 0.152: U4.3 13.34,24 13.56,24.23 JP7.2
D+  (via drill 0.3)
  Top 0.152: v8.28,8.9 8,9.17 7.76,9.41 J15.B6 5.32,9.41 5.21,9.53 5.21,10.29 5.33,10.41 5.34,10.41 J15.A6
  Bottom 0.152: U2.12 12.06,10.79 10.16,8.89 8.38,8.89 8.38,8.9 v8.28,8.9
D-  (via drill 0.3)
  Top 0.152: v8.23,9.73 7.8,9.73 7.62,9.91 7.49,9.91 | 7.49,9.91 J15.A7 | J15.B7 7.38,10.91 7.49,10.79 7.49,9.91
  Bottom 0.152: U2.11 10.79,10.03 10.54,9.78 8.28,9.78 v8.23,9.73
GND  (via drill 0.3)
  Top 0.152: C2.2 17.78,18.8 18.03,18.54 18.29,18.54 18.54,18.29 18.54,17.27 v17.78,16.51 | U1.7 18.73,31.43 U1.9
  Top 0.254: U1.12 18.84,33.02 v19.05,33.02 19.26,33.02 U1.11 | U1.13 18.84,30.48 v19.05,30.48 19.26,30.48 U1.10
  Bottom 0.152: C9.2 3.39,9.31 v2.54,10.16
  other vias: 15.24,10.16 3.81,21.84 3.81,17.78 21.59,17.78 20.32,27.94 19.05,31.75 15.37,26.04 15.24,5.97 15.24,4.45 17.78,10.16 19.05,13.97 10.29,5.97 2.54,7.62 2.54,12.95 11.94,14.22
  pour Bottom (isolate 0.305, rank 2): 0,0 0,50.8 25.4,50.8 25.4,0
  pour Top (isolate 0.305, rank 2): 0,0 0,50.8 25.4,50.8 25.4,0
IN+AMP
  Top 0.152: U1.3 20.9,32.08 21.21,32.38 21.21,32.89 21.34,33.02 R11.2
IN-AMP  (via drill 0.3)
  Top 0.152: R5.2 20.57,34.54 v20.32,34.29 20.32,33.66 20.52,33.45 U1.4 | R9.2 20.83,38.1 20.32,37.59 v20.32,37.34
  Bottom 0.152: v20.32,34.29 v20.32,37.34
MP3-RXI  (via drill 0.3)
  Top 0.152: U4.13 14.61,16.51 14.22,16.13 v13.97,16.13
  Bottom 0.152: U2.15 15.88,14.22 v13.97,16.13
MP3-TXO  (via drill 0.3)
  Top 0.152: v17.14,15.24 13.72,15.24 13.08,15.88 13.08,16.51 13.34,16.76 U4.12
  Bottom 0.152: U2.16 v17.14,15.24
N$1  (via drill 0.3)
  Top 0.152: J15.B5 3.02,8.41 v2.54,8.89
  Bottom 0.152: v2.54,8.89 2.33,9.11 R13.2
N$2  (via drill 0.3)
  Top 0.152: J15.A5 2.56,11.41 v2.54,11.43
  Bottom 0.152: R14.2 2.33,11.21 v2.54,11.43
N$3
  Top 0.152: D1.A 23.74,25.17 R3.1
N$5
  Top 0.152: C8.2 R9.1
N$8
  Top 0.152: R11.1 22.99,33.02 22.86,32.89 22.86,31.88 22.48,31.5 C5.2
N$9
  Top 0.152: C7.2 R5.1
OUT+
  Top 0.254: J9.P3 J9.P1 14.7,32.48 JP12.1 16.51,33.02 16.8,32.73 U1.5
OUT-
  Top 0.254: J9.P4 J9.P2 14.51,28.48 15.24,29.21 JP12.2 15.54,30.77 U1.8
PLAYING  (via drill 0.3)
  Top 0.152: U4.11 12.06,15.88 v12.7,15.24
  Bottom 0.152: U2.14 14.61,14.61 13.97,15.24 v12.7,15.24
SCL  (via drill 0.3)
  Top 0.152: v11.43,19.05 10.16,19.05 9.53,18.41 U4.9 9.53,14.61 | v10.16,10.41 10.16,7.24 13.59,3.81 13.97,3.81 | R2.1 22.86,6.35 20.32,3.81 13.97,3.81 | J3.4 13.97,3.81 | J2.4 6.1,18.82 6.6,18.31 6.6,15.75 7.75,14.61 9.53,14.61 | J4.4 21.57,21.82 v21.59,21.84 | v10.79,14.61 9.53,14.61
  Bottom 0.152: J7.3 19.05,25.4 20.32,25.4 21.59,24.13 v21.59,21.84 21.59,20.32 20.32,19.05 v11.43,19.05 | v10.16,10.41 10.16,13.97 v10.79,14.61
SCL_PU1
  Top 0.152: JP9.1 22.61,10.67 22.86,10.41 R2.2
SD_CLK  (via drill 0.3)
  Top 0.152: R4.2 9.31,10.25 9.02,10.54 v8.26,10.54
  Bottom 0.152: J1.SCLK 6.64,20.03 8.26,18.41 U2.9 v8.26,10.54
SD_CMD
  Bottom 0.152: U2.10 9.53,18.03 6.86,20.7 6.86,21.97 6.59,22.23 J1.DI
SD_DAT
  Bottom 0.152: U2.8 8.26,8.13 7.67,8.71 7.67,17.3 7.92,17.55 7.92,18.01 7.6,18.34 7.13,18.34 6.63,17.83 J1.DO
SDA  (via drill 0.3)
  Top 0.152: J3.3 11.43,2.54 8.51,5.46 v7.37,5.46 | 7.62,19.81 7.62,19.94 8.26,20.57 | R6.1 v20.32,5.59 | J2.3 7.61,19.82 7.62,19.81 | 8.26,20.57 U4.7 | v8.89,20.57 8.26,20.57 | J7.4 19.05,25.4 v19.05,21.59 19.05,21.21 19.44,20.82 J4.3 | 7.62,19.81 7.62,18.03 v7.37,17.78
  Bottom 0.152: v7.37,5.46 v7.37,17.78 | J3.3 11.43,2.54 12.06,3.17 17.91,3.17 v20.32,5.59 | v8.89,20.57 10.41,20.57 11.18,19.81 18.54,19.81 19.05,20.32 v19.05,21.59
SDA_PU1
  Top 0.152: JP9.3 20.57,10.67 20.32,10.41 R6.2
TRIGGER1  (via drill 0.3)
  Top 0.152: U4.8 8.26,18.41 9.65,19.81 9.65,21.21 8.89,21.97 v8.89,24.26 | J7.1 15.75,27.18 10.03,27.18 9.78,27.43 6.86,27.43 6.35,26.92 v6.35,26.16
  Bottom 0.152: J12.4 6.35,44.45 v6.35,26.16 6.35,25.91 8,24.26 v8.89,24.26
TRIGGER2  (via drill 0.3)
  Top 0.152: v8.89,26.67 v7.24,26.67 | U4.2 14.61,22.35 v13.97,21.72
  Bottom 0.152: v7.24,26.67 7.24,42.8 J12.3 | v8.89,26.67 11.43,26.67 13.97,24.13 v13.97,21.72
TRIGGER3  (via drill 0.3)
  Top 0.152: v10.16,24.26 10.54,24.26 10.79,24 U4.5
  Bottom 0.152: v10.16,24.26 8,26.42 8,27.81 7.75,28.07 7.75,40.77 J12.2
TRIGGER4  (via drill 0.3)
  Top 0.152: v5.08,30.73 v8.89,30.73 | U4.10 v10.79,16
  Bottom 0.152: v5.08,30.73 5.08,26.42 7.62,23.88 7.62,20.7 U4.10 v10.79,16 | J12.1 10.16,40.64 10.16,32 v8.89,30.73
VCCIO  (via drill 0.3)
  Top 0.152: 13.12,10.16 C1.1 13.12,12.66 12.7,13.08 12.7,14.25 12.17,14.78 11.71,14.78 11.38,14.46 11.38,14.3 11.05,13.97 10.41,13.97 10.31,14.07 7.72,14.07 6.43,15.37 4.57,15.37 v3.81,14.61 | 13.12,10.16 R1.2 | v13.08,10.16 13.12,10.16
  Bottom 0.152: U2.4 13.34,9.53 13.08,9.78 v13.08,10.16 | J1.VCC 4.37,21.13 2.92,19.68 2.92,17.65 3.81,16.76 v3.81,14.61 C9.1
VOUTL  (via drill 0.3)
  Top 0.152: v22.86,37.08 22.48,37.08 22.01,36.62 C7.1 C3.1
  Bottom 0.152: v22.86,37.08 24,35.94 24,15.75 22.86,14.61 18.54,14.61 18.29,14.35 18.29,12.19 17.14,11.05 U2.1
VOUTR  (via drill 0.3)
  Top 0.152: C6.1 C8.1 22.01,40.22 v21.59,40.64
  Bottom 0.152: U2.2 15.88,11.56 16.26,11.94 17.53,11.94 17.78,12.19 17.78,14.99 18.03,15.24 22.73,15.24 23.5,16 23.5,34.92 21.59,36.83 v21.59,40.64

### Text on the board
Bottom: X02
tValues: TPA2005D1